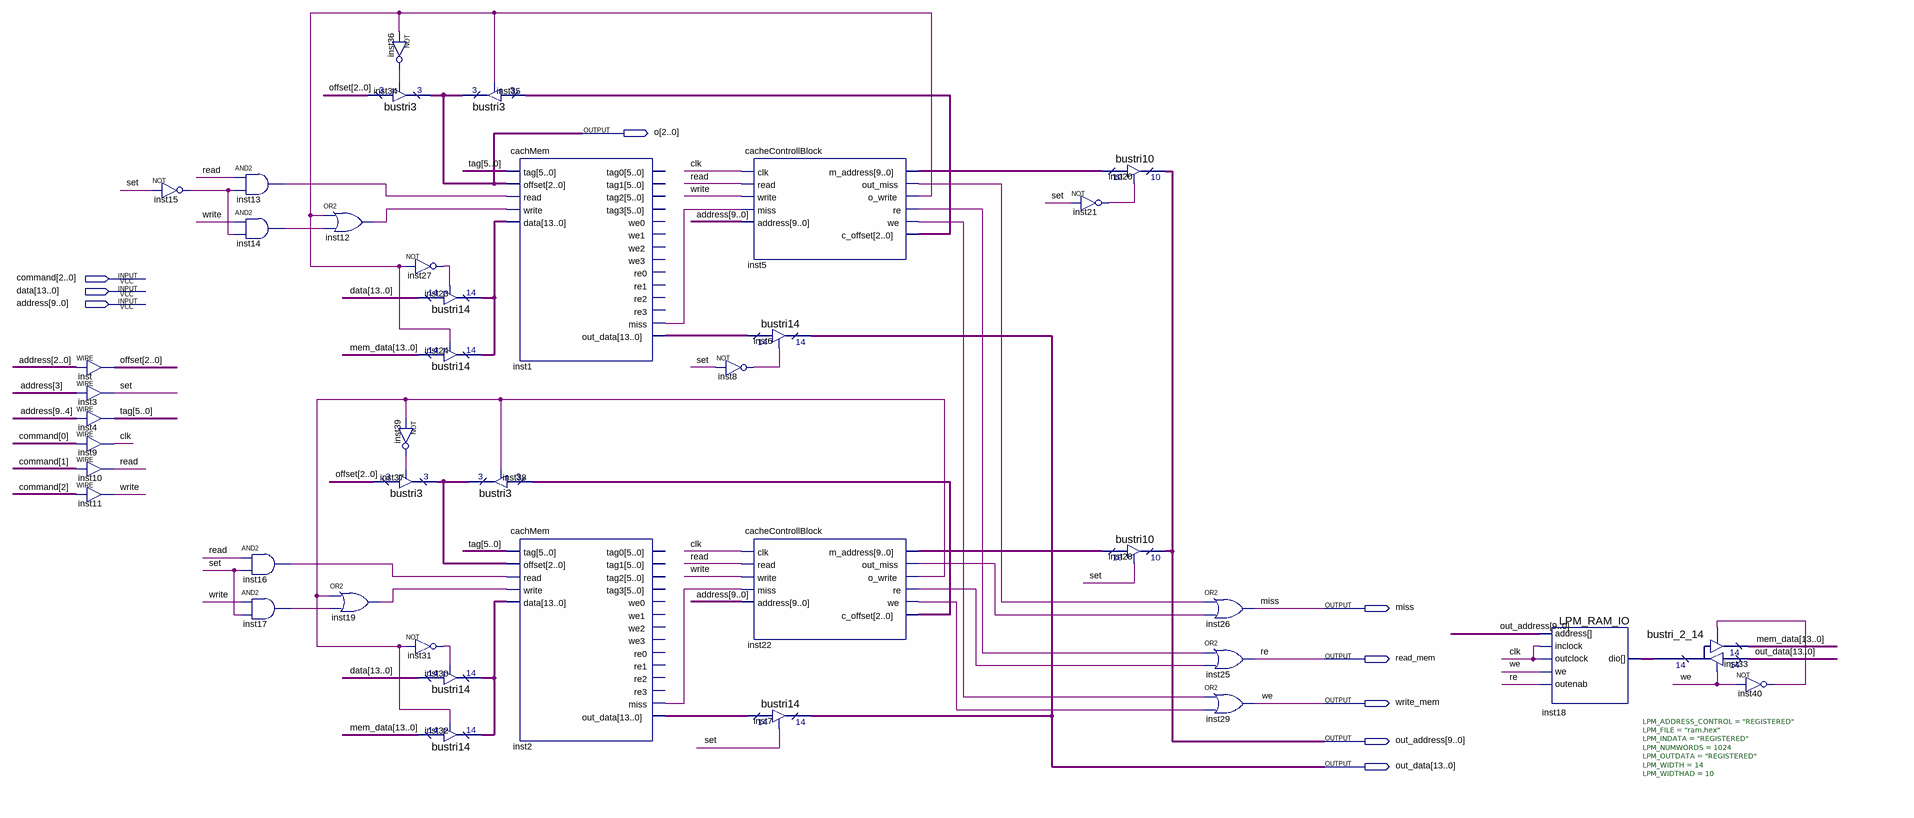
[diagram p0: schematic sheet]
// Quartus schematic cache.bdf as structural Verilog: 41 symbols, 9 pins
module cache (
  input  [2:0] command,
  input  [13:0] data,
  input  [9:0] address,
  output [2:0] o,
  output miss,
  output read_mem,
  output write_mem,
  output [9:0] out_address,
  output [13:0] out_data
);

  wire clk, inst1_miss, inst2_miss, inst5_o_write, inst5_out_miss, inst5_re, inst5_we, inst8_out, inst12_out,
       inst13_out, inst14_out, inst15_out, inst16_out, inst17_out, inst19_out, inst21_out, inst22_o_write,
       inst22_out_miss, inst22_re, inst22_we, inst27_out, inst31_out, inst36_out, inst39_out, inst40_out,
       read, set, write;
  wire [2:0] inst5_c_offset, inst22_c_offset, inst37_tridata, offset;
  wire [5:0] tag;
  wire [9:0] inst5_m_address, inst22_m_address;
  wire [13:0] inst1_out_data, inst2_out_data, inst18_dio, inst23_tridata, inst30_tridata, mem_data;

  assign offset = address[2:0];  // WIRE inst
  assign set = address[3];  // WIRE inst3
  assign tag = address[9:4];  // WIRE inst4
  assign clk = command[0];  // WIRE inst9
  assign read = command[1];  // WIRE inst10
  assign write = command[2];  // WIRE inst11
  not inst15 (inst15_out, set);
  and inst13 (inst13_out, read, inst15_out);
  and inst14 (inst14_out, write, inst15_out);
  and inst16 (inst16_out, read, set);
  and inst17 (inst17_out, write, set);
  or inst12 (inst12_out, inst5_o_write, inst14_out);
  or inst19 (inst19_out, inst22_o_write, inst17_out);
  not inst36 (inst36_out, inst5_o_write);
  bustri3 inst34 (.enabledt(inst36_out), .data(offset), .tridata(o));
  not inst39 (inst39_out, inst22_o_write);
  bustri3 inst37 (.enabledt(inst39_out), .data(offset), .tridata(inst37_tridata));
  not inst27 (inst27_out, inst5_o_write);
  bustri14 inst23 (.enabledt(inst27_out), .data(data), .tridata(inst23_tridata));
  bustri14 inst24 (.enabledt(inst5_o_write), .data(mem_data), .tridata(inst23_tridata));
  not inst31 (inst31_out, inst22_o_write);
  bustri14 inst30 (.enabledt(inst31_out), .data(data), .tridata(inst30_tridata));
  bustri14 inst32 (.enabledt(inst22_o_write), .data(mem_data), .tridata(inst30_tridata));
  bustri3 inst35 (.enabledt(inst5_o_write), .data(inst5_c_offset), .tridata(o));
  bustri3 inst38 (.enabledt(inst22_o_write), .data(inst22_c_offset), .tridata(inst37_tridata));
  cachMem inst1 (
    .tag(tag), .offset(o), .read(inst13_out), .write(inst12_out), .data(inst23_tridata), .miss(inst1_miss),
    .out_data(inst1_out_data));  // open: tag0, tag1, tag2, tag3, we0, we1, we2, we3, re0, re1, re2, re3
  cachMem inst2 (
    .tag(tag), .offset(inst37_tridata), .read(inst16_out), .write(inst19_out), .data(inst30_tridata),
    .miss(inst2_miss), .out_data(inst2_out_data));  // open: tag0, tag1, tag2, tag3, we0, we1, we2, we3, re0, re1, re2, re3
  cacheControllBlock inst5 (
    .clk(clk), .read(read), .write(write), .miss(inst1_miss), .address(address), .m_address(inst5_m_address),
    .out_miss(inst5_out_miss), .o_write(inst5_o_write), .re(inst5_re), .we(inst5_we),
    .c_offset(inst5_c_offset));
  bustri14 inst6 (.enabledt(inst8_out), .data(inst1_out_data), .tridata(out_data));
  not inst8 (inst8_out, set);
  cacheControllBlock inst22 (
    .clk(clk), .read(read), .write(write), .miss(inst2_miss), .address(address),
    .m_address(inst22_m_address), .out_miss(inst22_out_miss), .o_write(inst22_o_write), .re(inst22_re),
    .we(inst22_we), .c_offset(inst22_c_offset));
  bustri14 inst7 (.enabledt(set), .data(inst2_out_data), .tridata(out_data));
  bustri10 inst20 (.enabledt(inst21_out), .data(inst5_m_address), .tridata(out_address));
  not inst21 (inst21_out, set);
  bustri10 inst28 (.enabledt(set), .data(inst22_m_address), .tridata(out_address));
  or inst26 (miss, inst5_out_miss, inst22_out_miss);
  or inst25 (read_mem, inst5_re, inst22_re);
  or inst29 (write_mem, inst5_we, inst22_we);
  LPM_RAM_IO #(.LPM_ADDRESS_CONTROL("REGISTERED"), .LPM_FILE("ram.hex"), .LPM_INDATA("REGISTERED"), .LPM_NUMWORDS(1024), .LPM_OUTDATA("REGISTERED"), .LPM_WIDTH(14), .LPM_WIDTHAD(10)) inst18 (
    .address(out_address), .outclock(clk), .inclock(clk), .we(write_mem), .outenab(read_mem), .dio(inst18_dio));
  bustri_2_14 inst33 (
    .enabledt(write_mem), .data(out_data), .enabletr(inst40_out), .result(mem_data), .tridata(inst18_dio));
  not inst40 (inst40_out, write_mem);

  // Other names for the same wires on the sheet: re = read_mem; we = write_mem
endmodule
